# Altium schematic sheet 02_EFR32xG1x_DISC_REF_DES_A00_RfAntPower.SchDoc
size 420 x 297 mm
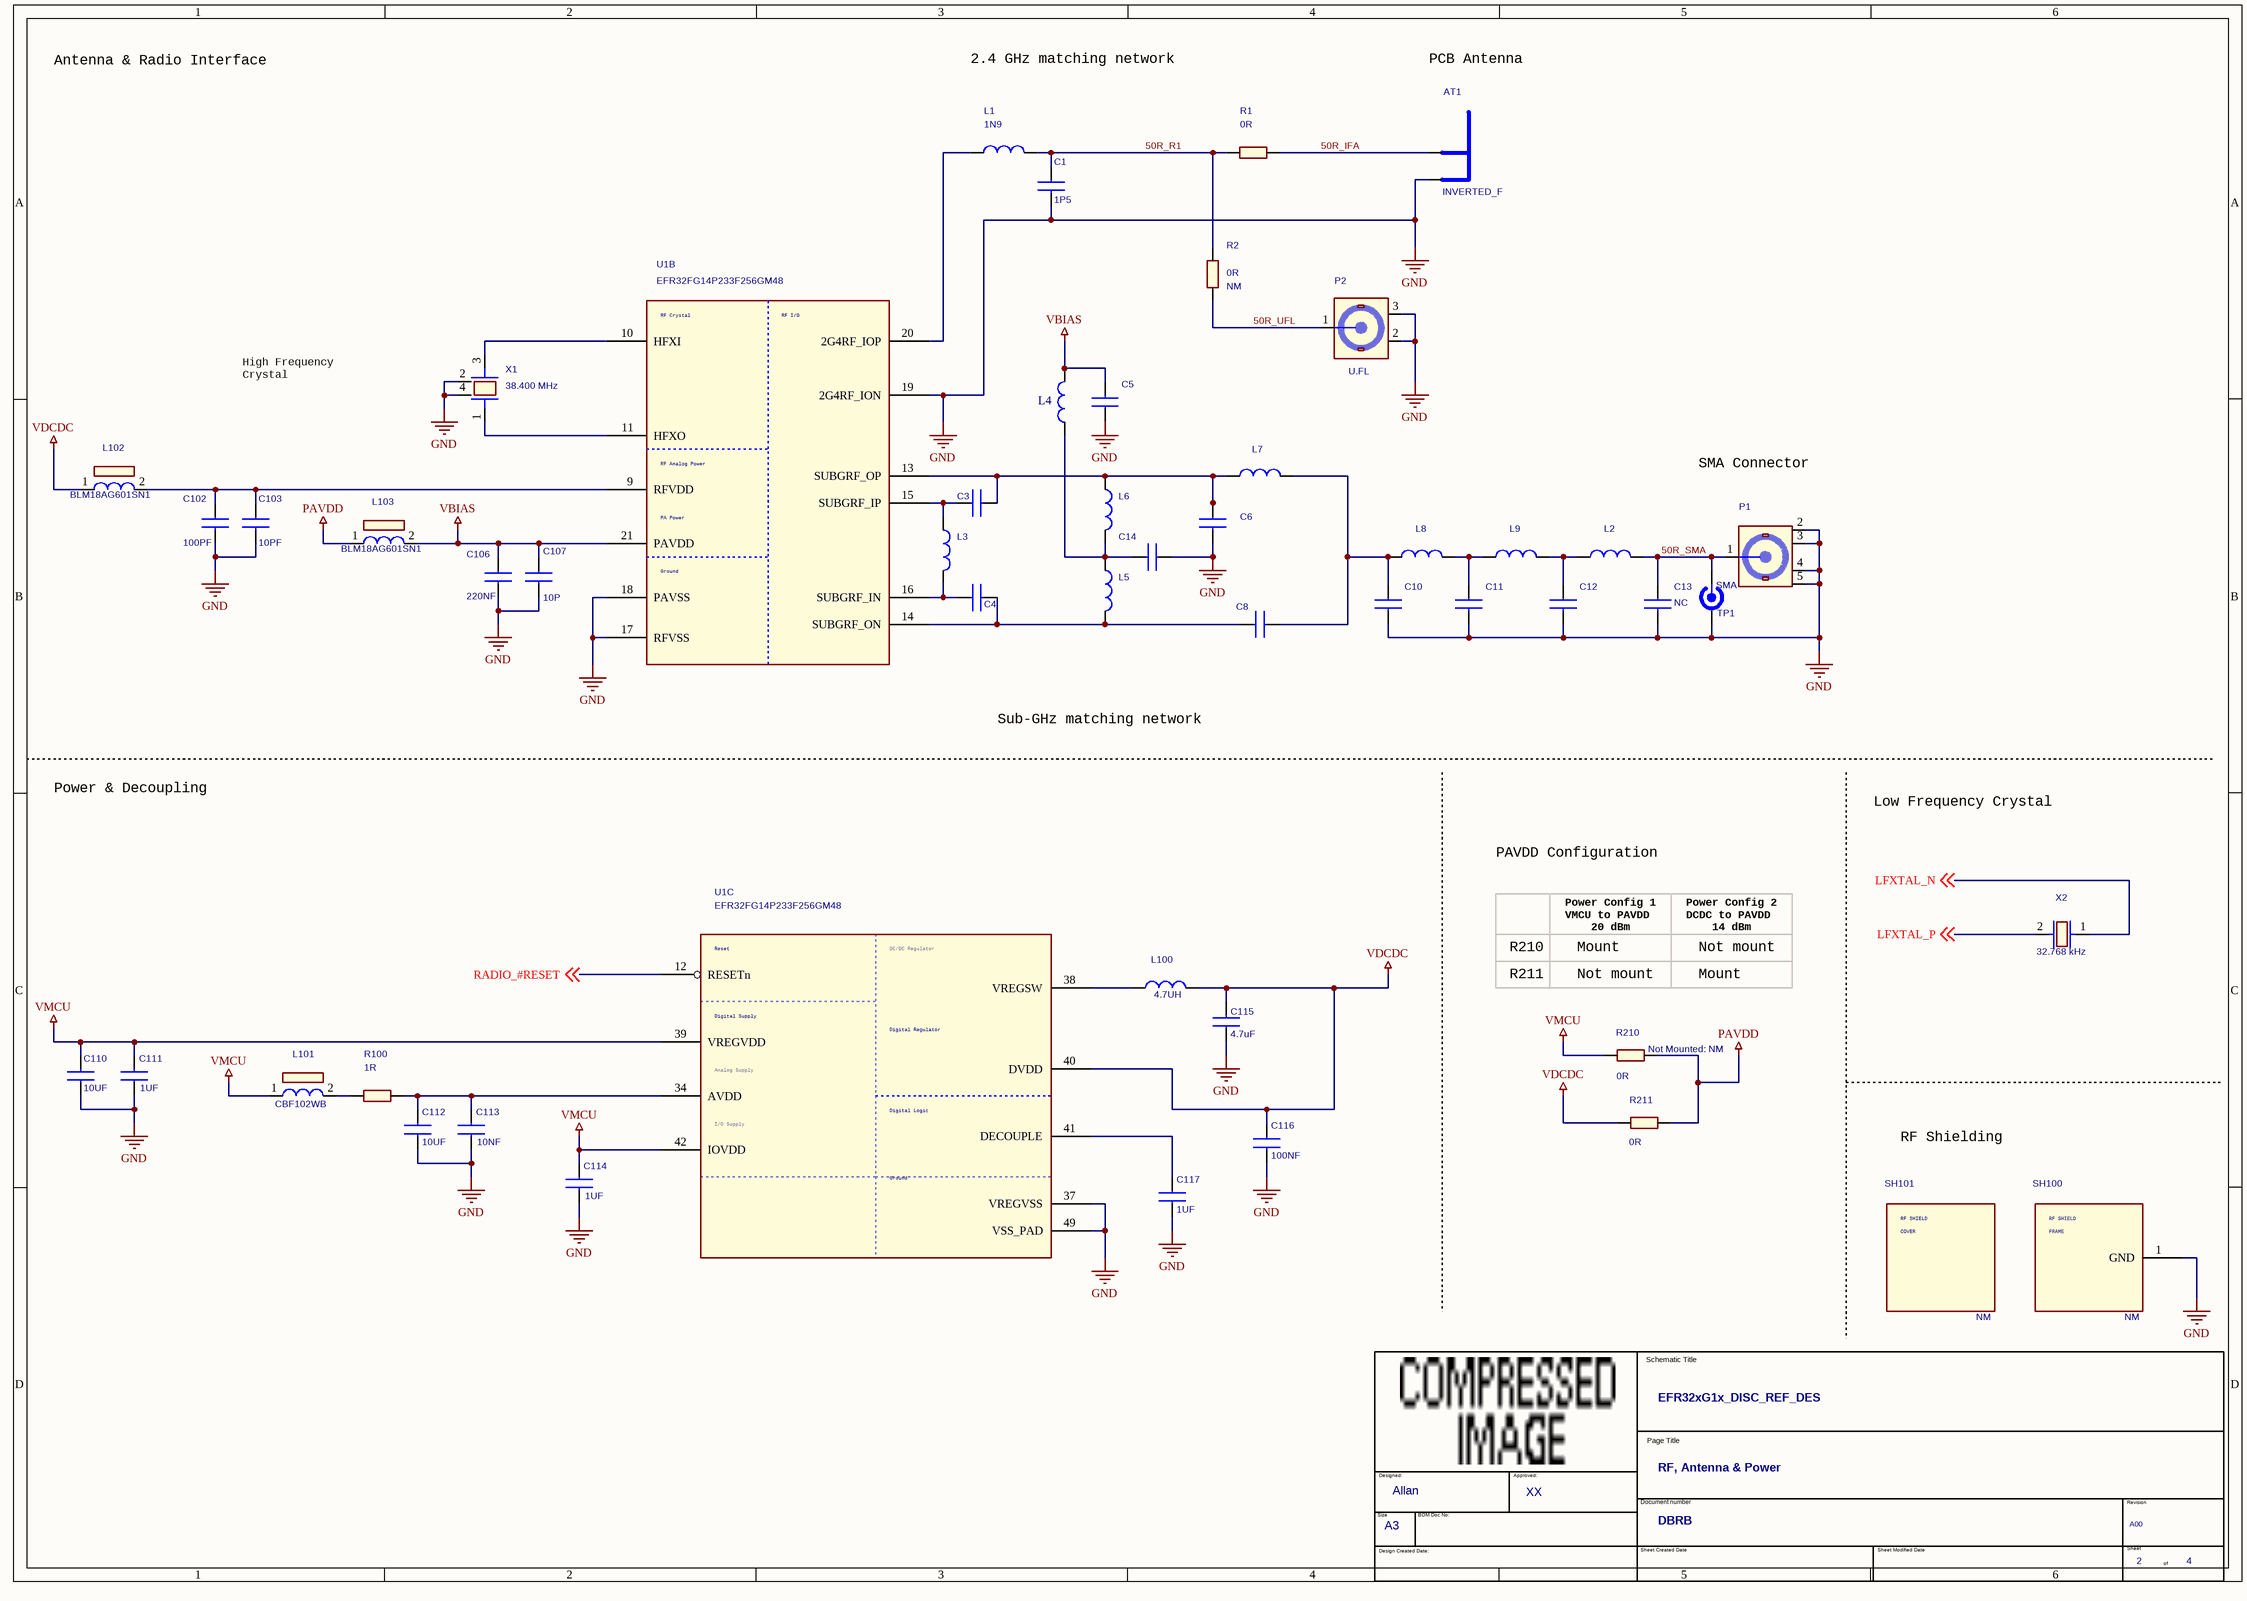
[diagram p0: 02_EFR32xG1x_DISC_REF_DES_A00_RfAntPower.SchDoc]

## Parts
*  OrgAddr2: XX  OrgAddr1: Allan  Page Count: 4  Page Number: 2  Doc: DBRB  Title: EFR32xG1x_DISC_REF_DES  RevCode: A00  Page Size: A3  Page Title: RF, Antenna & Power  (hidden comment: TitleBlock_EnergyMicro_A3)  (graphical)
AT1  INVERTED_F  [ANT_INV_F_2.4_GHZ_17.3MM_MIR]
C1  1P5  [C0201_L]
C3  1P8  [C0201_L]  (value not drawn)
C4  1P8  [C0201_L]  (value not drawn)
C5  270pF  [C0201_L]  (value not drawn)
C6  5.1P  [C0201_L]  (value not drawn)
C8  4P7  [C0201_L]  (value not drawn)
C10  6P2  [C0201_L]  (value not drawn)
C11  5.6P  [C0201_L]  (value not drawn)
C12  5P6  [C0201_L]  (value not drawn)
C13  NC  [C0201_L]
C14  2P  [C0201_L]  (value not drawn)
C102  100PF  [C0402_L]
C103  10PF  [C0402_L]
C106  220NF  [C0402_L]
C107  10P  [C0201_L]
C110  10UF  [C0603_L]
C111  1UF  [C0402_L]
C112  10UF  [C0603_L]
C113  10NF  [C0402_L]
C114  1UF  [C0402_L]
C115  4.7uF  [C0402_L]
C116  100NF  [C0402_L]
C117  1UF  [C0402_L]
L1  1N9  [COIL_0201_L]
L2  120P  [COIL_0201_L]  (value not drawn)
L3  75NH  [COIL_0201_L]  (value not drawn)
L4  330NH  [COIL_0402_L]  (value not drawn)
L5  12NH  [COIL_0201_L]  (value not drawn)
L6  12NH  [COIL_0201_L]  (value not drawn)
L7  27NH  [COIL_0201_L]  (value not drawn)
L8  24NH  [COIL_0201_L]  (value not drawn)
L9  24NH  [COIL_0201_L]  (value not drawn)
L100  4.7UH  [COIL_MUR_LQH3NP_1212]
L101  CBF102WB  [WURTH_CBF_0603]
L102  BLM18AG601SN1  [COIL_MUR_BLM18_0603]
L103  BLM18AG601SN1  [COIL_MUR_BLM18_0603]
P1  SMA  [TE_SMA_TH_1814832]
P2  U.FL  [HIROSE_U.FL-R-SMT-1]
R1  0R  [R0402_L]
R2  0R  Not Mounted: NM  [R0402_L]
R100  1R  [R0402_L]
R210  0R  Not Mounted: NM  [R0402_L]
R211  0R  [R0402_L]
SH100  Not Mounted: NM  [RF_SHIELD_FRAME_BMI-S-203-F_PCB4100]  (hidden comment: RF_SHIELD_FRAME_BMI-S-203-F)
SH101  Not Mounted: NM  (hidden comment: RF_SHIELD_COVER_BMI-S-203-C)
TP1  RF_TEST_POINT  [TP_INGUN_50_OHM_CLOSED openvia]  (value not drawn)
U1  EFR32FG14P233F256GM48  [QFN48_M050_SQ7.0_EP_SL_L]  (parts B,C of 3)
X1  38.400 MHz  [X_SSS_DSX211SH_2.05X1.65-4]
X2  32.768 kHz  [X_MCS_CM8V-T1A]

## Nets
GND: AT1.2(GND) C1.1 C5.2 C6.2 C10.2 C11.2 C12.2 C13.2 C14.2 C102.2 C103.2 C106.2 C107.2 C110.2 C111.2 C112.2 C113.2 C114.2 C115.2 C116.2 C117.2 P1.2(GND1) P1.3(GND2) P1.4(GND3) P1.5(GND4) P2.2(GND1) P2.3(GND4) SH100.1(GND) TP1.2(GND) U1.17(RFVSS) U1.18(PAVSS) U1.19(2G4RF_ION) U1.37(VREGVSS) U1.49(VSS_PAD) X1.2 X1.4
PAVDD: L103.1 R210.1 R211.1
VBIAS: C5.1 C106.1 C107.1 L4.1 L103.2 U1.21(PAVDD)
VDCDC: C115.1 C116.1 L100.2 L102.1 R211.2 U1.40(DVDD)
VMCU: C110.1 C111.1 C114.1 L101.1 R210.2 U1.39(VREGVDD) U1.42(IOVDD)
50R_IFA: AT1.1(ANT) R1.2
50R_R1: C1.2 L1.2 R1.1 R2.1
50R_SMA: C13.1 L2.1 P1.1(SIGNAL) TP1.1(RF)
50R_UFL: P2.1(SIGNAL) R2.2
LFXTAL_N: X2.1 ; off-sheet LFXTAL_N
LFXTAL_P: X2.2 ; off-sheet LFXTAL_P
RADIO_#RESET: U1.12(RESETn) ; off-sheet RADIO_#RESET
NetC3_1: C3.1 C6.1 L6.1 L7.2 U1.13(SUBGRF_OP)
NetC3_2: C3.2 L3.1 U1.15(SUBGRF_IP)
NetC4_1: C4.1 C8.2 L5.2 U1.14(SUBGRF_ON)
NetC4_2: C4.2 L3.2 U1.16(SUBGRF_IN)
NetC8_1: C8.1 C10.1 L7.1 L8.2
NetC11_1: C11.1 L8.1 L9.2
NetC12_1: C12.1 L2.2 L9.1
NetC14_1: C14.1 L4.2 L5.1 L6.2
NetC102_1: C102.1 C103.1 L102.2 U1.9(RFVDD)
NetC112_1: C112.1 C113.1 R100.2 U1.34(AVDD)
NetC117_1: C117.1 U1.41(DECOUPLE)
NetL1_1: L1.1 U1.20(2G4RF_IOP)
NetL100_1: L100.1 U1.38(VREGSW)
NetL101_2: L101.2 R100.1
NetU1_10: U1.10(HFXI) X1.3
NetU1_11: U1.11(HFXO) X1.1

## Notes on the sheet
- Antenna & Radio Interface
- 2.4 GHz matching network
- PCB Antenna
- High Frequency
  Crystal
- SMA Connector
- Sub-GHz matching network
- Power & Decoupling
- PAVDD Configuration
- Low Frequency Crystal
- Power Config 1
  VMCU to PAVDD
  20 dBm
- Power Config 2
  DCDC to PAVDD
  14 dBm
- R210
- R211
- Not mount
- Mount
- RF Shielding
- (in symbol EFR32-DUALBAND-QFN48, part B) RF Crystal; RF I/O; RF Analog Power; PA Power; Ground
- (in symbol EFR32-DUALBAND-QFN48, part C) Reset; DC/DC Regulator; Digital Supply; Digital Regulator; Analog Supply; Digital Logic; I/O Supply; Ground
- (in symbol RF_SHIELD_COVER_BMI-S-203-C) RF SHIELD; COVER
- (in symbol RF_SHIELD_FRAME_BMI-S-203-F) RF SHIELD; FRAME
- (in symbol TitleBlock_EnergyMicro_A3) Schematic Title; Page Title; Designed:; Approved:; Document number; Revision; Size; BOM Doc No:; Design Created Date:; Sheet Created Date; Sheet Modified Date; Sheet; of

## Library data of the parts
AT1 = ANT_INVERTED_F
C1 = C0402: Tolerance: ?.05P; Mfg: Murata; Mfg #: GRM1555C1H1R5WA01D; Technology: C0G
C3 C4 = C0402: Tolerance: ?.05P; Mfg: Murata; Mfg #: GRM1555C1H1R6WA01D; Technology: C0G
C5 C10 = C0402: Tolerance: ?.1P; Mfg: Murata; Mfg #: GRM1555C1H6R2BA01D; Technology: C0G
C6 = C0402
C8 C14 = C0402: Tolerance: ?%; Mfg: Murata; Mfg #: GRM1555C1H271FA01D; Technology: C0G
C11 = C0402: Tolerance: ?%; Mfg: Murata; Mfg #: GRM1555C1H110GA01D; Technology: C0G
C12 C13 = C0402: Tolerance: ?.05pF; Mfg: Murata; Mfg #: GRM1555C1H5R6WA01D; Technology: C0G
C102 C103 C107 = C0402: Rating: 50V; Tolerance: 5%; Technology: C0G
C106 C113 C116 = C0402: Rating: 16V; Tolerance: 10%; Technology: X7R
C110 C112 = C0603: Rating: 6.3V; Tolerance: 20%; Technology: X5R
C111 C114 C117 = C0402: Rating: 25V; Tolerance: 10%; Technology: X5R
C115 = C0402: Rating: 6.3V; Tolerance: 10%; Technology: X5R
L1 = L0402: Mfg: Murata; Mfg #: LQP15MN1N9W02D; Tolerance: ?.05N
L2 L8 L9 = L0402: Mfg: Murata; Mfg #: LQW15AN24NG00D; Tolerance: ?%
L3 L5 L6 = L0402
L4 = L0603
L7 = L0402: Mfg: Murata; Mfg #: LQW15AN18NG00D; Tolerance: ?%
L100 = LQH3NP: Mfg: Murata; Mfg #: LQH3NPN4R7MM0L
L101 = CBF102WB: Mfg: W黵th Electronics; Mfg #: 74279266; Price_1K: 0.031
L102 L103 = BLM18AG: Mfg: Murata; Mfg #: BLM18AG601SN1D; Price_1K: 0.027
P1 = SMA_TH: Mfg #: 5-1814832-1; Mfg: TE Connectivity; Price_1K: 1.46
P2 = HIROSE_U.FL: Mfg: Hirose; Mfg #: U.FL-R-SMT-1; Price_1K: 0.70
R1 R2 R100 R210 R211 = R0402: Price_1K: 0.005
SH100 = RF_SHIELD_FRAME_BMI-S-203-F: Mfg: Laird Technologies; Price_1k: 1.148; Mfg #: BMI-S-203-F; Footprint: Laird_BMI-S-203-F
SH101 = RF_SHIELD_COVER_BMI-S-203-C: Mfg: Laird Technologies; Mfg #: BMI-S-203-C; Price_1k: 0.814
TP1 = TP_RF
U1 = EFR32-DUALBAND-QFN48: MFG: Silicon Labs; MFG #: EFR32FG14P233F256GM48-BR
X1 = DSX211SH: Mfg: KDS; Mfg #: DSX211SH 1ZZNAE38400AB0A; Price_1K: 0.512
X2 = CM8V-T1A: Mfg: KDS; Mfg #: DST210 1TJG125DP1A0012; Price_1K: 0.3